# EasyEDA Pro project ZIAD_DBW_PROJECT_EDIT_9_MAY_2025.epro, schematic DBW_v4.1

## Sheets
1 DBW_v4.1_A
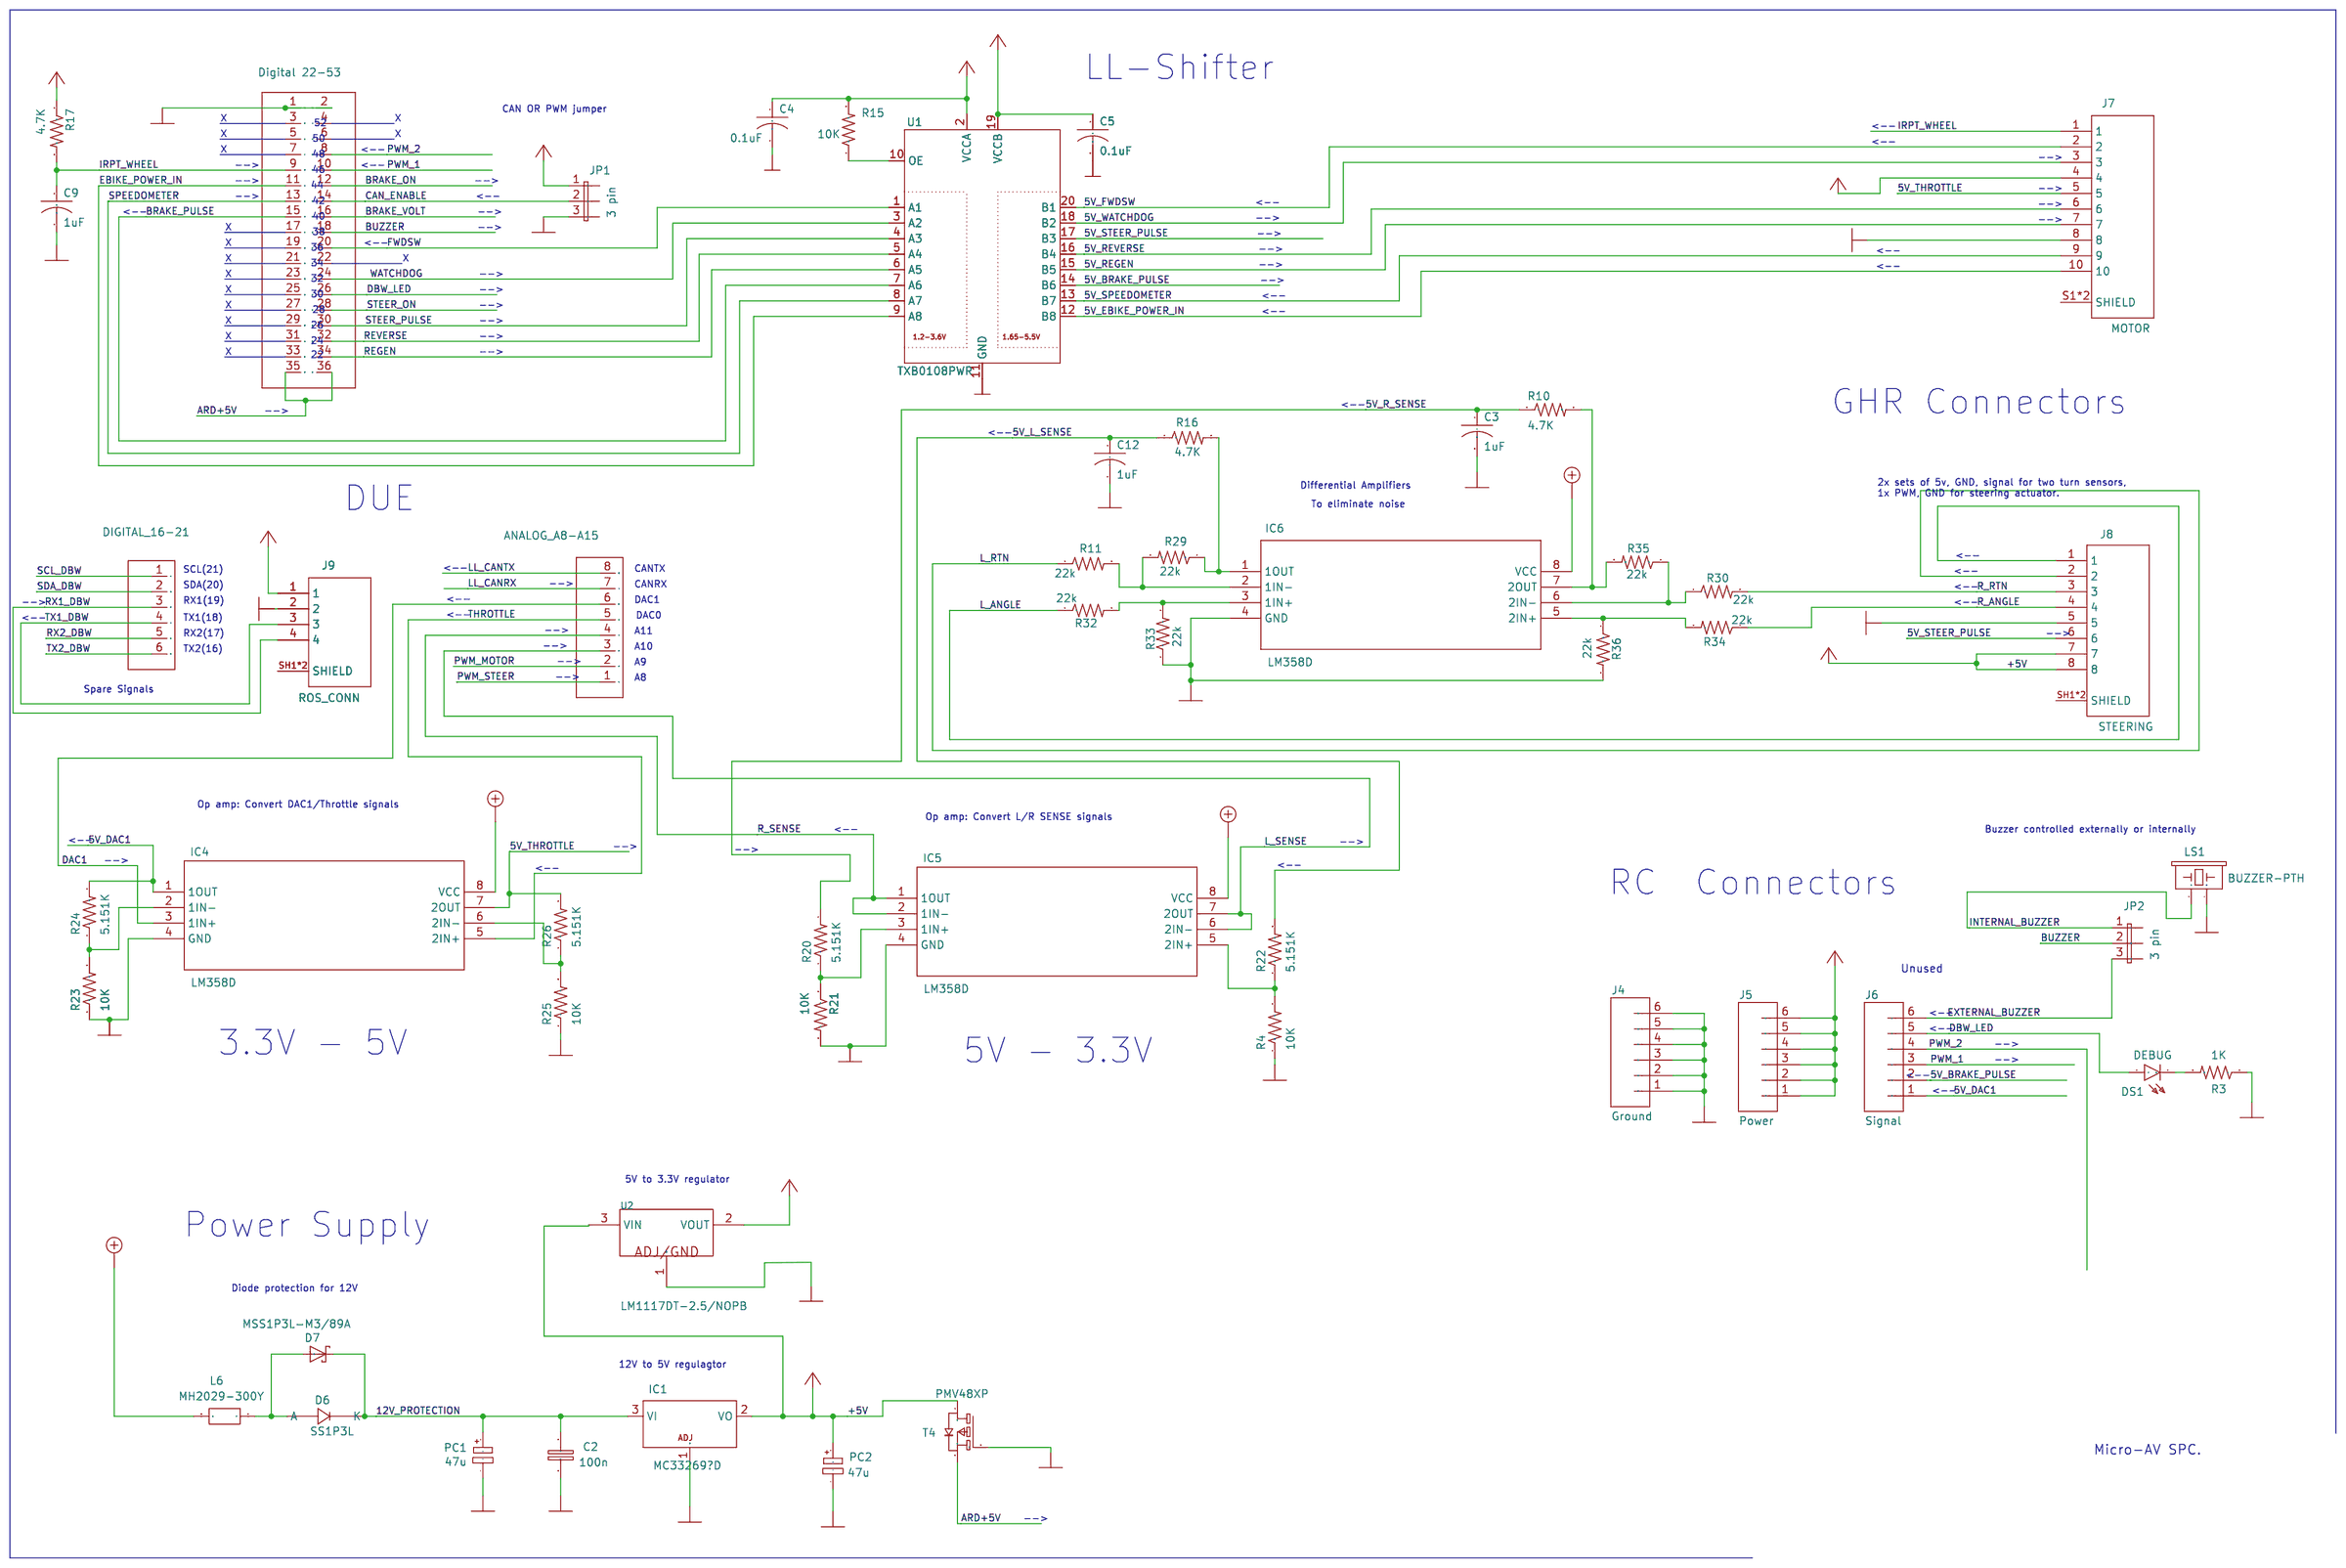
[diagram p1: DBW_v4.1_A]
2 DBW_v4.1_B
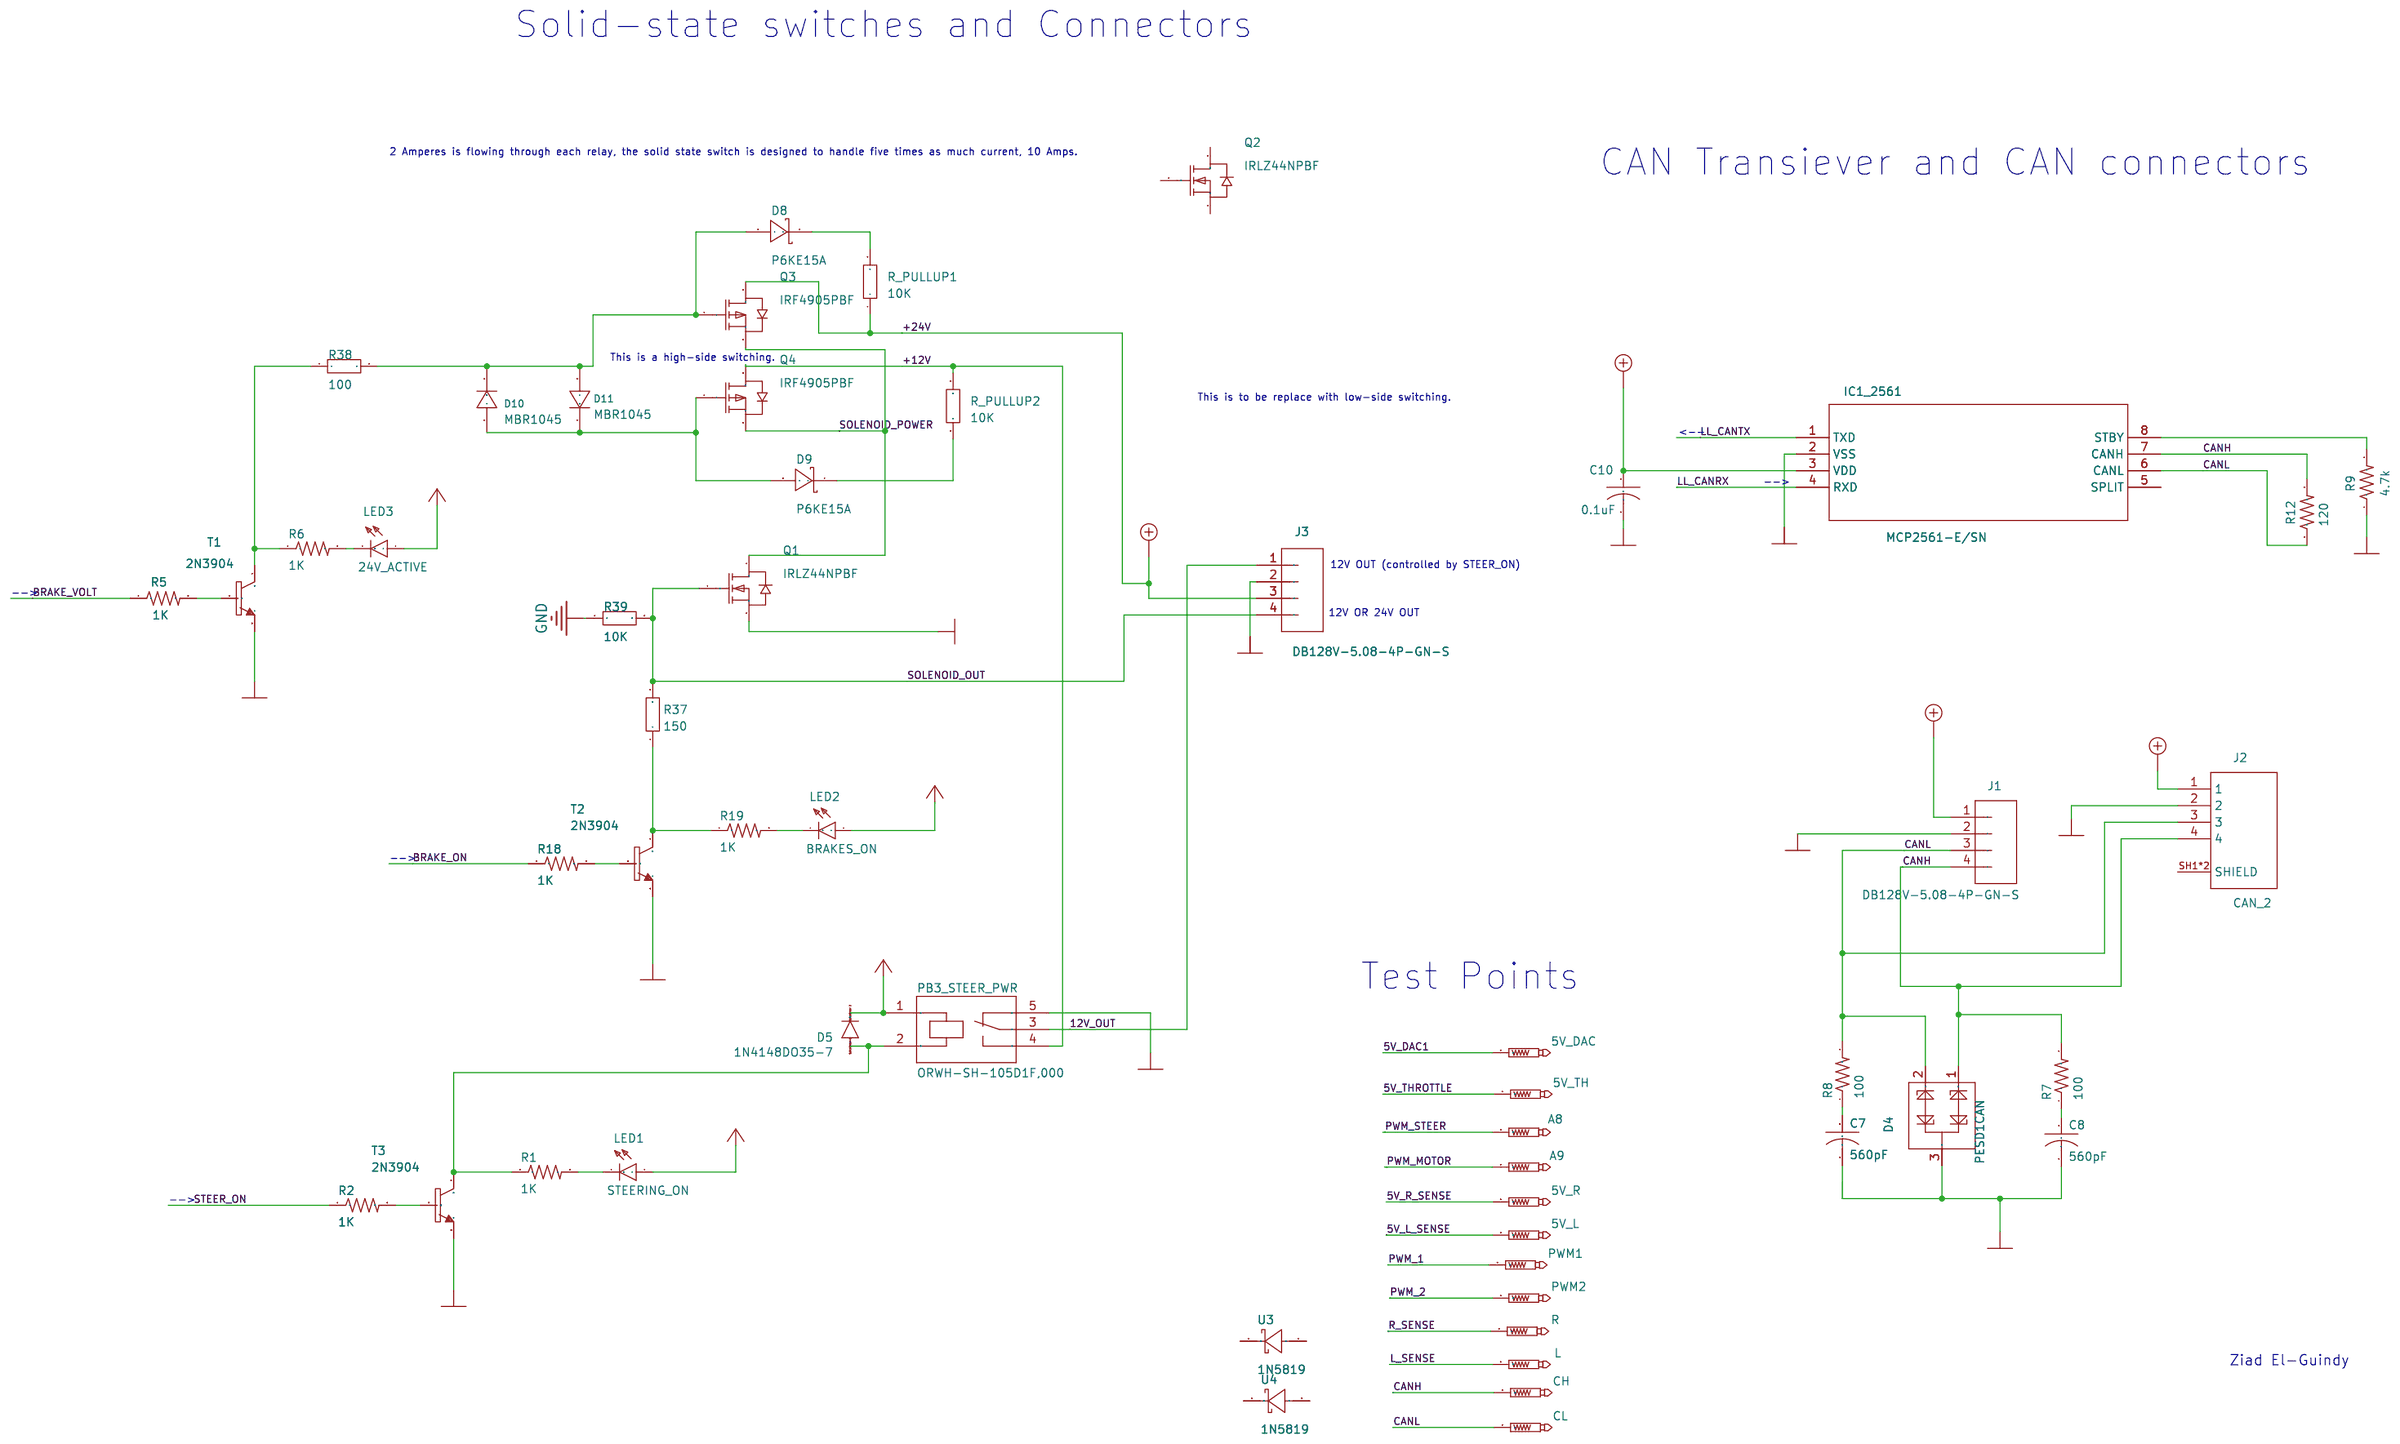
[diagram p2: DBW_v4.1_B]

## Parts
sheet DBW_v4.1_A
ANALOG_A8-A15  ANALOG_A8-A15  [1X08]
C2  100n  [C0603]
C3  1uF  [C1206]
C4  0.1uF  [C1206]
C5  0.1uF  [C1206]
C9  1uF  [C1206]
C12  1uF  [C1206]
D6  SS1P3L  [DO220AAL]
D7  MSS1P3L-M3/89A  [MICROSMP]
DEBUG  DS1  [LED3MM]
DIGITAL_16-21  DIGITAL_16-21  [1X06]
DIGITAL_22-53  Digital 22-53  [PINHEAD_2X18]
IC1  MC33269?D  [DPACK]
IC4  LM358D  [D8]
IC5  LM358D  [D8]
IC6  LM358D  [D8]
J4  Ground  [1X06]
J5  Power  [1X06]
J6  Signal  [1X06]
J7  MOTOR  [JST_SM10B-GHS-TB(LF)(SN)]
J8  STEERING  [JST_SM08B-GHS-TB(LF)(SN)]
J9  ROS_CONN  [JST_SM04B-GHS-TB(LF)(SN)-]
JP1  3 pin  [JP2]
JP2  3 pin  [JP2]
L6  MH2029-300Y  [0805]
LS1  BUZZER-PTH  [BUZZER-12MM]
PC1  47u  [PANASONIC_D]
PC2  47u  [PANASONIC_D]
R3  1K  [R1206]
R4  10K  [R1206]
R10  4.7K  [R0603]
R11  22k  [R0603]
R15  10K  [R1206]
R16  4.7K  [R0603]
R17  4.7K  [R1206]
R20  5.151K  [R1206]
R21  10K  [R1206]
R22  5.151K  [R1206]
R23  10K  [R1206]
R24  5.151K  [R1206]
R25  10K  [R1206]
R26  5.151K  [R1206]
R29  22k  [R0603]
R30  22k  [R0603]
R32  22k  [R0603]
R33  22k  [R0603]
R34  22k  [R0603]
R35  22k  [R0603]
R36  22k  [R0603]
T4  PMV48XP  [SOT-23]
U1  TXB0108PWR  [TSSOP20]
U2  LM1117DT-2.5/NOPB  [TO-252-2_L6.6-W6.1-P4.57-LS9.7-BR-CW]
sheet DBW_v4.1_B
5V_DAC  PTR1PAD1-17  [P1-17]
5V_L  PTR1PAD1-17  [P1-17]
5V_R  PTR1PAD1-17  [P1-17]
5V_TH  PTR1PAD1-17  [P1-17]
24V_ACTIVE  LED3  [LED3MM]
A8  PTR1PAD1-17  [P1-17]
A9  PTR1PAD1-17  [P1-17]
BRAKES_ON  LED2  [LED3MM]
C7  560pF  [C1206]
C8  560pF  [C1206]
C10  0.1uF  [C1206]
CH  PTR1PAD1-17  [P1-17]
CL  PTR1PAD1-17  [P1-17]
D4  PESD1CAN  [SPARKFUN-DISCRETESEMI_SOT23-3]
D5  1N4148DO35-7  [DO35-7]
D8  P6KE15A  [DO-15_BD3.1-L6.7-P10.70-D0.9-RD]
D9  P6KE15A  [DO-15_BD3.1-L6.7-P10.70-D0.9-RD]
D10  MBR1045  [TO-220AC_L10.0-W4.5-P5.08-T]
D11  MBR1045  [TO-220AC_L10.0-W4.5-P5.08-T]
IC1_2561  MCP2561-E/SN  [SOIC8-N_MC_MCH]
J1  DB128V-5.08-4P-GN-S  [CONN-TH_4P-P5.08_DIBO_DB128V-5.08]
J2  CAN_2  [JST_SM04B-GHS-TB(LF)(SN)-]
J3  DB128V-5.08-4P-GN-S  [CONN-TH_4P-P5.08_DIBO_DB128V-5.08]
L  PTR1PAD1-17  [P1-17]
PB3_STEER_PWR  ORWH-SH-105D1F,000  [TE_ORWH-SH-105D1F,000]
PWM1  PTR1PAD1-17  [P1-17]
PWM2  PTR1PAD1-17  [P1-17]
Q1  IRLZ44NPBF  [TO-220-3_L10.0-W4.5-P2.54-T]
Q2  IRLZ44NPBF  [TO-220-3_L10.0-W4.5-P2.54-T]
Q3  IRF4905PBF  [TO-220-3_L10.0-W4.5-P2.54-T]
Q4  IRF4905PBF  [TO-220-3_L10.0-W4.5-P2.54-T]
R  PTR1PAD1-17  [P1-17]
R1  1K  [R1206]
R2  1K  [R1206]
R5  1K  [R1206]
R6  1K  [R1206]
R7  100  [R1206]
R8  100  [R1206]
R9  4.7k  [R1206]
R12  120  [R1206]
R18  1K  [R1206]
R19  1K  [R1206]
R37  150  [R1206]
R38  100  [R1206]
R39  10K  [R1206]
R_PULLUP1  10K  [R1206]
R_PULLUP2  10K  [R1206]
STEERING_ON  LED1  [LED3MM]
T1  2N3904  [TO92]
T2  2N3904  [TO92]
T3  2N3904  [TO92]
U3  1N5819  [DO-41_BD2.4-L4.7-P8.70-D0.6-RD]
U4  1N5819  [DO-41_BD2.4-L4.7-P8.70-D0.6-RD]

## Library data of the parts
ANALOG_A8-A15 = pinhead_PINHD-1X8_
C2 = rcl_C-EU_C0603
C3 C7-C10 C12 = resistor_C-US_C1206
C4 C5 = adafruit_C-US_C1206
D6 = Diodi_0025_SS1P3L-M3/84A_
D7 = Diodi_1653_MSS1P3L-M3/89A_
24V_ACTIVE BRAKES_ON DEBUG STEERING_ON = led_LED_3MM
DIGITAL_16-21 = pinhead_PINHD-1X6_
DIGITAL_22-53 = elcanoParts_PINHEAD_PINHD-2X18_
IC1 = linear_MC33269?*_D
IC4-IC6 = LM358D_LM358D_
J4-J6 = SparkFun-Connectors_CONN_06_SILK_FEMALE_PTH
J7 = SM10B-GHS-TB_LF__SN__SM10B-GHS-TB(LF)(SN)_
J8 = SM08B-GHS-TB_LF__SN__SM08B-GHS-TB(LF)(SN)_
J2 J9 = SM04B-GHS-TB_LF__SN_-_SM04B-GHS-TB(LF)(SN)-_
JP1 JP2 = jumper_JP2E_
L6 = Protezione_0001_BLM21PG300SN1D_/_MH2029-300Y_
LS1 = SparkFun-Electromechanical_BUZZER_-PTH
PC1 PC2 = rcl_CPOL-EU_D
R1-R3 R5-R9 R12 R17-R19 = resistor_R-US__R1206
R4 R20-R26 = rcl_R-US__R1206
R10 R11 R16 R29 R30 R32-R36 = resistor_R-US__R0603
R15 = adafruit_R-US__R1206
T4 = Transistors_0297_PMV48XP_
U1 = microbuilder_TXB0108PWR_
U2 = LM1117DT-2.5/NOPB: Output Type:固定 Maximum Input Voltage:15V Output Voltage:2.5V Output Voltage:2.5V MAX Output Current:800mA Power Supply Rejection Ratio (PSRR):75dB@(120Hz) Dropout Voltage:1.2V@(800mA) standby current:5mA Operating Temperature:0℃~+125℃ Operating Temperatur; Supplier Part: C2877365; Manufacturer: TI(德州仪器); Supplier Footprint: TO-252-2; JLCPCB Part Class: Extended Part; Datasheet: https://www.ti.com/cn/lit/gpn/lm1117; Supplier: LCSC; Output Type: 固定; Maximum Input Voltage: 15V; Output Voltage: 2.5V; MAX Output Current: 800mA; Power Supply Rejection Ratio (PSRR): 75dB@(120Hz); Dropout Voltage: 1.2V@(800mA); standby current: 5mA; Operating Temperature: 0℃~+125℃; Output Polarity: Positive electrode; Number of Outputs: 1
5V_DAC 5V_L 5V_R 5V_TH A8 A9 CH CL L PWM1 PWM2 R = testpad_PTR1_PAD1-17
D4 = elcanoParts_PESD1CAN_
D5 = diode_1N4148_DO35-7
D8 D9 = P6KE15A: Reverse Stand-Off Voltage (Vrwm):13V Maximum Clamping Voltage:21.2V Peak Pulse Current (Ipp)@10/1000us:28A Peak Pulse Power Dissipation (Ppp)@10/1000us:600W Breakdown Voltage:14.3V Type:TVS; LCSC Part Name: 单向TVS 13V截止 28A峰值脉冲; Supplier Part: C133732; Manufacturer: ST(意法半导体); Supplier Footprint: DO-15; JLCPCB Part Class: Extended Part; Datasheet: https://atta.szlcsc.com/upload/public/pdf/source/20191219/C472522_93C0B1E37B0EA0366E2390D02212F250.pdf; Supplier: LCSC; Reverse Stand-Off Voltage (Vrwm): 13V; Maximum Clamping Voltage: 21.2V; Peak Pulse Current (Ipp)@10/1000us: 28A; Peak Pulse Power Dissipation (Ppp)@10/1000us: 600W; Breakdown Voltage: 14.3V; Type: TVS
D10 D11 = MBR1045: Forward Voltage (Vf@If):650mV@10A Reverse Voltage (Vr):45V Average Rectified Current (Io):10A Reverse Leakage Current (Ir):1mA@45V@45V; LCSC Part Name: 电压:45V 电流:10A; Supplier Part: C260253; Manufacturer: SMC(桑德斯); Supplier Footprint: TO-220AC-2; JLCPCB Part Class: Extended Part; Datasheet: https://atta.szlcsc.com/upload/public/pdf/source/20181009/C260253_7D573DE3AABB9B5002B848B23408B9EB.pdf; Supplier: LCSC; Forward Voltage (Vf@If): 650mV@10A; Reverse Voltage (Vr): 45V; Average Rectified Current (Io): 10A; Reverse Leakage Current (Ir): 1mA@45V@45V
IC1_2561 = MCP2561-E-SN_MCP2561-E/SN_
J1 J3 = DB128V-5.08-4P-GN-S: Number of Positions or Pins:1x4P Pitch:5.08mm Color:Green Mounting Type:Direct Insert Number of Pins:4P Number of Rows:1 Number of PINs Per Row:4 Screw Specification:M2.5 Current Rating:16A Voltage Rating (Max):300V Wire Gauge - AWG:12~22 Wire Gauge - AWG; LCSC Part Name: 1x4P 5.08mm 直插 排数:1 每排P数:4; Supplier Part: C2915641; Manufacturer: DORABO(地博电气); Supplier Footprint: 插件,P=5.08mm; JLCPCB Part Class: Extended Part; Datasheet: https://atta.szlcsc.com/upload/public/pdf/source/20230106/CC449C10514519CDCE20F1C37DBF2DAC.pdf; Supplier: LCSC; Number of Positions or Pins: 1x4P; Pitch: 5.08mm; Color: Green; Mounting Type: Direct Insert; Number of Pins: 4P; Number of Rows: 1; Number of PINs Per Row: 4; Screw Specification: M2.5; Current Rating: 16A; Voltage Rating (Max): 300V; Wire Gauge - AWG: 12~22; Wire Gauge - mm2: 2.5; Operating Temperature: -40℃~+105℃
PB3_STEER_PWR = elcanoParts_ORWH-SH-105D1F,000_
Q1 Q2 = IRLZ44NPBF: Type:1 N-Channel Drain Source Voltage (Vdss): Continuous Drain Current (Id): Drain Source On Resistance (RDS(on)@Vgs,Id):0.025Ω@5.0V,25A Power Dissipation (Pd): Gate Threshold Voltage (Vgs(th)@Id):1V@250uA Total Gate Charge (Qg@Vgs):48nC Input Capacitance; LCSC Part Name: 1个N沟道 耐压:55V 电流:47A; Supplier Part: C38774; Manufacturer: Infineon(英飞凌); Supplier Footprint: TO-220AB; JLCPCB Part Class: Extended Part; Datasheet: https://atta.szlcsc.com/upload/public/pdf/source/20141125/1457707250505.pdf; Supplier: LCSC; Type: 1 N-Channel; Drain Source On Resistance (RDS(on)@Vgs,Id): 0.025Ω@5.0V,25A; Gate Threshold Voltage (Vgs(th)@Id): 1V@250uA; Total Gate Charge (Qg@Vgs): 48nC; Input Capacitance (Ciss@Vds): 1.7nF; Reverse Transfer Capacitance (Crss@Vds): 150pF; Operating Temperature: -55℃~+175℃
Q3 Q4 = IRF4905PBF: Type:1 Piece P-Channel Drain Source Voltage (Vdss): Continuous Drain Current (Id): Drain Source On Resistance (RDS(on)@Vgs,Id):0.02Ω@10V,38A Power Dissipation (Pd): Gate Threshold Voltage (Vgs(th)@Id):2V@250uA Total Gate Charge (Qg@Vgs):180nC@10V Input Ca; LCSC Part Name: 1个P沟道 耐压:55V 电流:74A; Supplier Part: C2564; Manufacturer: Infineon(英飞凌); Supplier Footprint: TO-220AB; JLCPCB Part Class: Extended Part; Datasheet: https://atta.szlcsc.com/upload/public/pdf/source/20140818/1457707225921.pdf; Supplier: LCSC; Type: 1 Piece P-Channel; Drain Source On Resistance (RDS(on)@Vgs,Id): 0.02Ω@10V,38A; Gate Threshold Voltage (Vgs(th)@Id): 2V@250uA; Total Gate Charge (Qg@Vgs): 180nC@10V; Input Capacitance (Ciss@Vds): 3.4nF; Reverse Transfer Capacitance (Crss@Vds): 640pF; Operating Temperature: -55℃~+175℃
R37-R39 R_PULLUP1 R_PULLUP2 = Res_0603: Supplier Footprint: 0603
T1-T3 = transistor_2N3904_
U3 U4 = 1N5819_C7450408: Voltage - Forward(Vf@If):550mV@1A Voltage - DC Reverse(Vr):40V Current - Rectified:1A; LCSC Part Name: 电压:40V 电流:1A; Supplier Part: C7450408; Manufacturer: LJ(朗捷); Supplier Footprint: DO-41; JLCPCB Part Class: Extended Part; Datasheet: https://atta.szlcsc.com/upload/public/pdf/source/20230810/74AFAB1D59EA58AAD3231CCEED05A03F.pdf; Supplier: LCSC; Voltage - Forward(Vf@If): 550mV@1A; Voltage - DC Reverse(Vr): 40V; Current - Rectified: 1A

## Nets
5V_BRAKE_PULSE: J6.2 U1.14(B6)
5V_DAC1: 5V_DAC.TP IC4.1(1OUT) J6.1 R24.2
5V_EBIKE_POWER_IN: J7.10 U1.12(B8)
5V_FWDSW: J7.2 U1.20(B1)
5V_L_SENSE: 5V_L.TP C12.1 R16.1 R22.2
5V_R_SENSE: 5V_R.TP C3.1 R10.1 R20.2
5V_REGEN: J7.7 U1.15(B5)
5V_REVERSE: J7.6 U1.16(B4)
5V_SPEEDOMETER: J7.9 U1.13(B7)
5V_STEER_PULSE: J8.6 U1.17(B3)
5V_THROTTLE: 5V_TH.TP IC4.7(2OUT) J7.5 R26.2
5V_WATCHDOG: J7.3 U1.18(B2)
12V_OUT: J3.1 PB3_STEER_PWR.3(C)
12V_PROTECTION: C2.2 D6.P$1(K) D7.K(C) IC1.3(VI) PC1.+
+3V3: C4.1 JP1.1 R15.2 R17.1 U1.2(VCCA)
+5V: 24V_ACTIVE.A BRAKES_ON.A C5.1 C10.1 D5.C IC1.2(VO) IC1_2561.3(VDD) J2.1 J5.1 J5.2 J5.3 J5.4 J5.5 J5.6 J7.4 J8.7 J8.8 J9.1 PB3_STEER_PWR.1(C1) PC2.+ STEERING_ON.A T4.1(D) U1.19(VCCB) U2.3(VIN)
+12V: IC4.8(VCC) IC5.8(VCC) IC6.8(VCC) J1.1 L6.2 PB3_STEER_PWR.4(NC) Q4.2(D) R_PULLUP2.2
+24V: J3.3 Q3.2(D) R_PULLUP1.1
GND: C2.1 C3.2 C4.2 C5.2 C7.2 C8.2 C9.2 C10.2 C12.2 D4.3 DIGITAL_22-53.1 DIGITAL_22-53.2 IC1.1(ADJ) IC1_2561.2(VSS) IC4.4(GND) IC5.4(GND) IC6.4(GND) J1.2 J2.2 J3.2 J4.1 J4.2 J4.3 J4.4 J4.5 J4.6 J7.8 J8.5 J9.2 JP1.3 LS1.-(2) PB3_STEER_PWR.5(NO) PC1.- PC2.- Q1.3(S) R3.1 R4.1 R9.1 R21.2 R23.1 R25.1 R33.1 R36.2 R39.1 T1.3(E) T2.3(E) T3.3(E) T4.3(G) U1.11(GND) U2.1(ADJ/GND)
ARD+5V: DIGITAL_22-53.35 DIGITAL_22-53.36 T4.2(S)
BRAKE_ON: DIGITAL_22-53.12 R18.1
BRAKE_PULSE: DIGITAL_22-53.15 U1.7(A6)
BRAKE_VOLT: DIGITAL_22-53.16 R5.1
BUZZER: DIGITAL_22-53.18 JP2.2
CAN_ENABLE: DIGITAL_22-53.14 JP1.2
CANH: CH.TP D4.1 IC1_2561.7(CANH) J1.4 J2.4 R7.2 R12.2
CANL: CL.TP D4.2 IC1_2561.6(CANL) J1.3 J2.3 R8.2 R12.1
DAC1: ANALOG_A8-A15.6 IC4.3(1IN+)
DBW_LED: DEBUG.A DIGITAL_22-53.26 J6.5
EBIKE_POWER_IN: DIGITAL_22-53.11 U1.9(A8)
EXTERNAL_BUZZER: J6.6 JP2.3
FWDSW: DIGITAL_22-53.20 U1.1(A1)
INTERNAL_BUZZER: JP2.1 LS1.+(1)
IRPT_WHEEL: C9.1 DIGITAL_22-53.9 J7.1 R17.2
L_ANGLE: J8.1 R32.1
L_RTN: J8.2 R11.1
L_SENSE: ANALOG_A8-A15.3 IC5.6(2IN-) IC5.7(2OUT) L.TP
LL_CANRX: ANALOG_A8-A15.7 IC1_2561.4(RXD)
LL_CANTX: ANALOG_A8-A15.8 IC1_2561.1(TXD)
N$2: R5.2 T1.2(B)
N$3: C8.1 R7.1
N$4: 24V_ACTIVE.K(C) R6.2
N$5: R2.2 T3.2(B)
N$6: D6.P$2(A) D7.A L6.1
N$7: R18.2 T2.2(B)
N$8: D5.A PB3_STEER_PWR.2(C2) R1.1 T3.1(C)
N$9: C7.1 R8.1
N$10: R1.2 STEERING_ON.K(C)
N$13: BRAKES_ON.K(C) R19.2
N$14: IC6.2(1IN-) R11.2 R29.2
N$15: IC6.3(1IN+) R32.2 R33.2
N$16: DEBUG.K(C) R3.2
N$17: IC5.5(2IN+) R4.2 R22.1
N$18: IC4.2(1IN-) R23.2 R24.1
N$19: IC4.6(2IN-) R25.2 R26.1
N$20: R15.1 U1.10(OE)
N$22: IC6.1(1OUT) R16.2 R29.1
N$23: IC6.5(2IN+) R34.2 R36.1
N$24: IC5.3(1IN+) R20.1 R21.1
N$25: IC6.7(2OUT) R10.2 R35.2
N$26: IC6.6(2IN-) R30.1 R35.1
N$44: IC1_2561.8(STBY) R9.2
PWM_1: DIGITAL_22-53.10 J6.3 PWM1.TP
PWM_2: DIGITAL_22-53.8 J6.4 PWM2.TP
PWM_MOTOR: A9.TP ANALOG_A8-A15.2
PWM_STEER: A8.TP ANALOG_A8-A15.1
R_ANGLE: J8.4 R34.1
R_RTN: J8.3 R30.2
R_SENSE: ANALOG_A8-A15.4 IC5.1(1OUT) IC5.2(1IN-) R.TP
REGEN: DIGITAL_22-53.34 U1.6(A5)
REVERSE: DIGITAL_22-53.32 U1.5(A4)
RX1_DBW: DIGITAL_16-21.3 J9.4
RX2_DBW: DIGITAL_16-21.5
SCL_DBW: DIGITAL_16-21.1
SDA_DBW: DIGITAL_16-21.2
SOLENOID_OUT: J3.4 Q1.1(G) R37.2 R39.2
SOLENOID_POWER: Q1.2(D) Q3.3(S) Q4.3(S)
SPEEDOMETER: DIGITAL_22-53.13 U1.8(A7)
STEER_ON: DIGITAL_22-53.28 R2.1
STEER_PULSE: DIGITAL_22-53.30 U1.4(A3)
THROTTLE: ANALOG_A8-A15.5 IC4.5(2IN+)
TX1_DBW: DIGITAL_16-21.4 J9.3
TX2_DBW: DIGITAL_16-21.6
WATCHDOG: DIGITAL_22-53.24 U1.3(A2)
$2N2317: D8.1(K) R_PULLUP1.2
$2N2321: D9.2(A) D10.2(A) D11.1(C) Q4.1(G)
$2N2325: D9.1(K) R_PULLUP2.1
$2N2595: R19.1 R37.1 T2.1(C)
$2N2647: D8.2(A) D10.1(C) D11.2(A) Q3.1(G) R38.2
$2N2653: R6.1 R38.1 T1.1(C)

Not connected (* = marked no-connect by the designer): DIGITAL_22-53 3 4 5 6 7 17 19 21 22 23 25 27 29 31 33; IC1_2561 5(SPLIT); J2 SH1*2(SHIELD); J7 S1*2(SHIELD); J8 SH1*2(SHIELD); J9 SH1*2(SHIELD); Q2 1(G) 2(D) 3(S); U2 2(VOUT); U3 1(K) 2(A); U4 1(K) 2(A)

## Notes on the sheets
sheet 1
- LL-Shifter
- X
- 52
- X
- CAN OR PWM jumper
- X
- 50
- X
- <--
- <--
- X
- 48
- <--
- -->
- -->
- 46
- <--
- -->
- -->
- 44
- -->
- <--
- -->
- <--
- 42
- -->
- <--
- -->
- X
- 38
- 40
- -->
- -->
- -->
- -->
- X
- 36
- <--
- -->
- <--
- X
- 34
- X
- -->
- <--
- X
- X
- 32
- -->
- -->
- -->
- X
- 30
- -->
- <--
- X
- 26
- 28
- -->
- <--
- X
- 24
- -->
- X
- 22
- -->
- -->
- <--
- GHR Connectors
- <--
- Differential Amplifiers
- 2x sets of 5v, GND, signal for two turn sensors,
  1x PWM, GND for steering actuator.
- DUE
- To eliminate noise
- <--
- SCL(21)
- <--
- -->
- CANTX
- <--
- RX1(19)
- SDA(20)
- <--
- CANRX
- DAC1
- <--
- -->
- <--
- TX1(18)
- <--
- DAC0
- <--
- RX2(17)
- -->
- A11
- -->
- TX2(16)
- -->
- A10
- -->
- A9
- Spare Signals
- -->
- A8
- Op amp: Convert DAC1/Throttle signals
- Op amp: Convert L/R SENSE signals
- <--
- <--
- Buzzer controlled externally or internally
- -->
- -->
- -->
- -->
- <--
- <--
- RC  Connectors
- Unused
- <--
- <--
- 3.3V - 5V
- 5V - 3.3V
- -->
- -->
- <--
- <--
- 5V to 3.3V regulator
- Power Supply
- Diode protection for 12V
- 12V to 5V regulagtor
- Micro-AV SPC.
- -->
sheet 2
- Solid-state switches and Connectors
- 2 Amperes is flowing through each relay, the solid state switch is designed to handle five times as much current, 10 Amps.
- CAN Transiever and CAN connectors
- This is a high-side switching.
- This is to be replace with low-side switching.
- <--
- -->
- 12V OUT (controlled by STEER_ON)
- -->
- 12V OR 24V OUT
- -->
- Test Points
- -->
- Ziad El-Guindy
